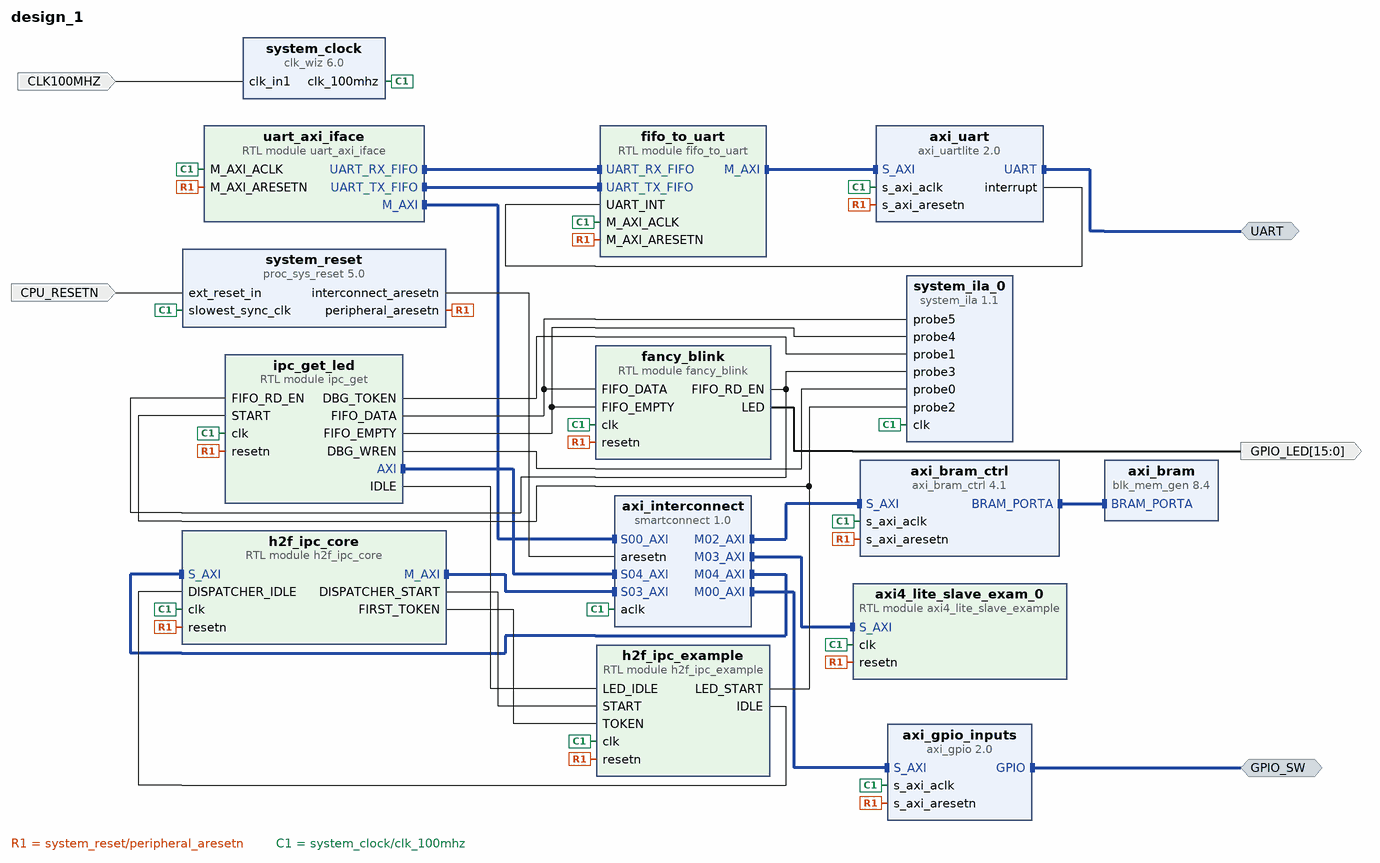
[diagram p0: block diagram of the top level]
# Vivado block design design_1, xc7a100tcsg324-1, Vivado 2021.1
create_bd_design design_1

create_bd_intf_port -mode Master -vlnv xilinx.com:interface:gpio_rtl:1.0 GPIO_SW
create_bd_intf_port -mode Master -vlnv xilinx.com:interface:uart_rtl:1.0 UART
create_bd_port -dir I -type clk CLK100MHZ
set_property -dict {CONFIG.ASSOCIATED_RESET CPU_RESETN} [get_bd_ports CLK100MHZ]
create_bd_port -dir I -type rst CPU_RESETN
create_bd_port -dir O -from 15 -to 0 GPIO_LED

create_bd_cell -type ip -vlnv xilinx.com:ip:clk_wiz:6.0 system_clock
set_property -dict [list \
  CONFIG.CLKOUT1_DRIVES BUFGCE \
  CONFIG.CLKOUT1_JITTER 130.958 \
  CONFIG.CLKOUT1_REQUESTED_OUT_FREQ 100 \
  CONFIG.CLKOUT2_DRIVES BUFGCE \
  CONFIG.CLKOUT3_DRIVES BUFGCE \
  CONFIG.CLKOUT4_DRIVES BUFGCE \
  CONFIG.CLKOUT5_DRIVES BUFGCE \
  CONFIG.CLKOUT6_DRIVES BUFGCE \
  CONFIG.CLKOUT7_DRIVES BUFGCE \
  CONFIG.CLK_OUT1_PORT clk_100mhz \
  CONFIG.FEEDBACK_SOURCE FDBK_AUTO \
  CONFIG.MMCM_CLKOUT0_DIVIDE_F 10.000 \
  CONFIG.USE_LOCKED false \
  CONFIG.USE_RESET false \
  CONFIG.USE_SAFE_CLOCK_STARTUP true \
] [get_bd_cells system_clock]
create_bd_cell -type ip -vlnv xilinx.com:ip:proc_sys_reset:5.0 system_reset
set_property -dict {CONFIG.RESET_BOARD_INTERFACE reset CONFIG.USE_BOARD_FLOW true} [get_bd_cells system_reset]
create_bd_cell -type module -reference uart_axi_iface uart_axi_iface
create_bd_cell -type ip -vlnv xilinx.com:ip:smartconnect:1.0 axi_interconnect
set_property -dict {CONFIG.NUM_MI 6 CONFIG.NUM_SI 5} [get_bd_cells axi_interconnect]
create_bd_cell -type ip -vlnv xilinx.com:ip:axi_uartlite:2.0 axi_uart
set_property -dict [list \
  CONFIG.C_BAUDRATE 115200 \
  CONFIG.UARTLITE_BOARD_INTERFACE Custom \
  CONFIG.USE_BOARD_FLOW true \
] [get_bd_cells axi_uart]
create_bd_cell -type ip -vlnv xilinx.com:ip:axi_gpio:2.0 axi_gpio_inputs
set_property -dict [list \
  CONFIG.C_GPIO_WIDTH 4 \
  CONFIG.GPIO_BOARD_INTERFACE Custom \
  CONFIG.USE_BOARD_FLOW true \
] [get_bd_cells axi_gpio_inputs]
create_bd_cell -type module -reference fifo_to_uart fifo_to_uart
create_bd_cell -type ip -vlnv xilinx.com:ip:axi_bram_ctrl:4.1 axi_bram_ctrl
set_property -dict {CONFIG.DATA_WIDTH 256 CONFIG.SINGLE_PORT_BRAM 1} [get_bd_cells axi_bram_ctrl]
create_bd_cell -type ip -vlnv xilinx.com:ip:blk_mem_gen:8.4 axi_bram
set_property -dict [list \
  CONFIG.EN_SAFETY_CKT true \
  CONFIG.Memory_Type Single_Port_RAM \
  CONFIG.Port_B_Clock 0 \
  CONFIG.Port_B_Enable_Rate 0 \
  CONFIG.Port_B_Write_Rate 0 \
] [get_bd_cells axi_bram]
create_bd_cell -type ip -vlnv xilinx.com:ip:system_ila:1.1 system_ila_0
set_property -dict [list \
  CONFIG.C_MON_TYPE NATIVE \
  CONFIG.C_NUM_MONITOR_SLOTS 1 \
  CONFIG.C_NUM_OF_PROBES 6 \
  CONFIG.C_PROBE0_TYPE 0 \
  CONFIG.C_PROBE1_TYPE 0 \
  CONFIG.C_PROBE2_TYPE 0 \
  CONFIG.C_PROBE3_TYPE 0 \
  CONFIG.C_PROBE4_TYPE 0 \
  CONFIG.C_PROBE5_TYPE 0 \
  CONFIG.C_PROBE6_TYPE 0 \
  CONFIG.C_PROBE7_TYPE 0 \
  CONFIG.C_SLOT_0_APC_EN 0 \
  CONFIG.C_SLOT_0_AXI_AR_SEL_DATA 1 \
  CONFIG.C_SLOT_0_AXI_AR_SEL_TRIG 1 \
  CONFIG.C_SLOT_0_AXI_AW_SEL_DATA 1 \
  CONFIG.C_SLOT_0_AXI_AW_SEL_TRIG 1 \
  CONFIG.C_SLOT_0_AXI_B_SEL_DATA 1 \
  CONFIG.C_SLOT_0_AXI_B_SEL_TRIG 1 \
  CONFIG.C_SLOT_0_AXI_R_SEL_DATA 1 \
  CONFIG.C_SLOT_0_AXI_R_SEL_TRIG 1 \
  CONFIG.C_SLOT_0_AXI_W_SEL_DATA 1 \
  CONFIG.C_SLOT_0_AXI_W_SEL_TRIG 1 \
  CONFIG.C_SLOT_0_INTF_TYPE xilinx.com:interface:aximm_rtl:1.0 \
  CONFIG.C_SLOT_1_APC_EN 0 \
  CONFIG.C_SLOT_1_AXI_AR_SEL_DATA 1 \
  CONFIG.C_SLOT_1_AXI_AR_SEL_TRIG 1 \
  CONFIG.C_SLOT_1_AXI_AW_SEL_DATA 1 \
  CONFIG.C_SLOT_1_AXI_AW_SEL_TRIG 1 \
  CONFIG.C_SLOT_1_AXI_B_SEL_DATA 1 \
  CONFIG.C_SLOT_1_AXI_B_SEL_TRIG 1 \
  CONFIG.C_SLOT_1_AXI_R_SEL_DATA 1 \
  CONFIG.C_SLOT_1_AXI_R_SEL_TRIG 1 \
  CONFIG.C_SLOT_1_AXI_W_SEL_DATA 1 \
  CONFIG.C_SLOT_1_AXI_W_SEL_TRIG 1 \
  CONFIG.C_SLOT_1_INTF_TYPE xilinx.com:interface:aximm_rtl:1.0 \
] [get_bd_cells system_ila_0]
create_bd_cell -type module -reference axi4_lite_slave_example axi4_lite_slave_exam_0
create_bd_cell -type module -reference h2f_ipc_core h2f_ipc_core
create_bd_cell -type module -reference h2f_ipc_example h2f_ipc_example
create_bd_cell -type module -reference ipc_get ipc_get_led
create_bd_cell -type module -reference fancy_blink fancy_blink

# ---- connections ----

connect_bd_intf_net -intf_net axi_bram_ctrl_0_BRAM_PORTA [get_bd_intf_pins axi_bram/BRAM_PORTA] [get_bd_intf_pins axi_bram_ctrl/BRAM_PORTA]
connect_bd_intf_net [get_bd_intf_ports GPIO_SW] [get_bd_intf_pins axi_gpio_inputs/GPIO]
connect_bd_intf_net [get_bd_intf_pins axi_interconnect/M00_AXI] [get_bd_intf_pins axi_gpio_inputs/S_AXI]
connect_bd_intf_net [get_bd_intf_pins axi_bram_ctrl/S_AXI] [get_bd_intf_pins axi_interconnect/M02_AXI]
connect_bd_intf_net [get_bd_intf_pins axi_interconnect/M03_AXI] [get_bd_intf_pins axi4_lite_slave_exam_0/S_AXI]
connect_bd_intf_net [get_bd_intf_pins axi_interconnect/M04_AXI] [get_bd_intf_pins h2f_ipc_core/S_AXI]
connect_bd_intf_net [get_bd_intf_ports UART] [get_bd_intf_pins axi_uart/UART]
connect_bd_intf_net [get_bd_intf_pins axi_uart/S_AXI] [get_bd_intf_pins fifo_to_uart/M_AXI]
connect_bd_intf_net -intf_net h2f_ipc_core_0_M_AXI [get_bd_intf_pins h2f_ipc_core/M_AXI] [get_bd_intf_pins axi_interconnect/S03_AXI]
connect_bd_intf_net -intf_net ipc_get_0_AXI [get_bd_intf_pins ipc_get_led/AXI] [get_bd_intf_pins axi_interconnect/S04_AXI]
connect_bd_intf_net [get_bd_intf_pins axi_interconnect/S00_AXI] [get_bd_intf_pins uart_axi_iface/M_AXI]
connect_bd_intf_net [get_bd_intf_pins fifo_to_uart/UART_RX_FIFO] [get_bd_intf_pins uart_axi_iface/UART_RX_FIFO]
connect_bd_intf_net [get_bd_intf_pins fifo_to_uart/UART_TX_FIFO] [get_bd_intf_pins uart_axi_iface/UART_TX_FIFO]
connect_bd_net -net DBG_TOKEN [get_bd_pins ipc_get_led/DBG_TOKEN] [get_bd_pins system_ila_0/probe1]
connect_bd_net -net DBG_WREN [get_bd_pins ipc_get_led/DBG_WREN] [get_bd_pins system_ila_0/probe0]
connect_bd_net -net axi_uartlite_0_interrupt [get_bd_pins axi_uart/interrupt] [get_bd_pins fifo_to_uart/UART_INT]
connect_bd_net -net clk_in1_0_1 [get_bd_ports CLK100MHZ] [get_bd_pins system_clock/clk_in1]
connect_bd_net -net ext_reset_in_0_1 [get_bd_ports CPU_RESETN] [get_bd_pins system_reset/ext_reset_in]
connect_bd_net -net fancy_blink_0_FIFO_RD_EN [get_bd_pins fancy_blink/FIFO_RD_EN] \
  [get_bd_pins system_ila_0/probe3] [get_bd_pins ipc_get_led/FIFO_RD_EN]
connect_bd_net -net fancy_blink_0_LED [get_bd_pins fancy_blink/LED] [get_bd_ports GPIO_LED]
connect_bd_net [get_bd_pins h2f_ipc_core/DISPATCHER_START] [get_bd_pins h2f_ipc_example/START]
connect_bd_net [get_bd_pins h2f_ipc_core/FIRST_TOKEN] [get_bd_pins h2f_ipc_example/TOKEN]
connect_bd_net -net h2f_ipc_example_0_IDLE [get_bd_pins h2f_ipc_example/IDLE] [get_bd_pins h2f_ipc_core/DISPATCHER_IDLE]
connect_bd_net -net h2f_ipc_example_LED_START [get_bd_pins h2f_ipc_example/LED_START] \
  [get_bd_pins system_ila_0/probe2] [get_bd_pins ipc_get_led/START]
connect_bd_net -net ipc_get_0_IDLE [get_bd_pins ipc_get_led/IDLE] [get_bd_pins h2f_ipc_example/LED_IDLE]
connect_bd_net -net ipc_get_led_FIFO_DATA [get_bd_pins ipc_get_led/FIFO_DATA] [get_bd_pins system_ila_0/probe5] [get_bd_pins fancy_blink/FIFO_DATA]
connect_bd_net -net ipc_get_led_FIFO_EMPTY [get_bd_pins ipc_get_led/FIFO_EMPTY] [get_bd_pins system_ila_0/probe4] [get_bd_pins fancy_blink/FIFO_EMPTY]
connect_bd_net -net proc_sys_reset_0_peripheral_aresetn [get_bd_pins system_reset/peripheral_aresetn] \
  [get_bd_pins uart_axi_iface/M_AXI_ARESETN] [get_bd_pins axi_uart/s_axi_aresetn] [get_bd_pins axi_gpio_inputs/s_axi_aresetn] \
  [get_bd_pins fifo_to_uart/M_AXI_ARESETN] [get_bd_pins axi_bram_ctrl/s_axi_aresetn] \
  [get_bd_pins axi4_lite_slave_exam_0/resetn] [get_bd_pins h2f_ipc_core/resetn] [get_bd_pins h2f_ipc_example/resetn] \
  [get_bd_pins ipc_get_led/resetn] [get_bd_pins fancy_blink/resetn]
connect_bd_net [get_bd_pins system_clock/clk_100mhz] \
  [get_bd_pins system_reset/slowest_sync_clk] [get_bd_pins uart_axi_iface/M_AXI_ACLK] [get_bd_pins axi_interconnect/aclk] \
  [get_bd_pins axi_uart/s_axi_aclk] [get_bd_pins axi_gpio_inputs/s_axi_aclk] [get_bd_pins fifo_to_uart/M_AXI_ACLK] \
  [get_bd_pins axi_bram_ctrl/s_axi_aclk] [get_bd_pins system_ila_0/clk] [get_bd_pins axi4_lite_slave_exam_0/clk] \
  [get_bd_pins h2f_ipc_core/clk] [get_bd_pins h2f_ipc_example/clk] [get_bd_pins ipc_get_led/clk] \
  [get_bd_pins fancy_blink/clk]
connect_bd_net [get_bd_pins system_reset/interconnect_aresetn] [get_bd_pins axi_interconnect/aresetn]
set_property HDL_ATTRIBUTE.DEBUG true [get_bd_nets DBG_TOKEN]
set_property HDL_ATTRIBUTE.MARK_DEBUG true [get_bd_nets DBG_TOKEN]
set_property HDL_ATTRIBUTE.DEBUG true [get_bd_nets DBG_WREN]
set_property HDL_ATTRIBUTE.MARK_DEBUG true [get_bd_nets DBG_WREN]
set_property HDL_ATTRIBUTE.DEBUG true [get_bd_nets fancy_blink_0_FIFO_RD_EN]
set_property HDL_ATTRIBUTE.MARK_DEBUG true [get_bd_nets fancy_blink_0_FIFO_RD_EN]
set_property HDL_ATTRIBUTE.DEBUG true [get_bd_nets h2f_ipc_example_LED_START]
set_property HDL_ATTRIBUTE.MARK_DEBUG true [get_bd_nets h2f_ipc_example_LED_START]
set_property HDL_ATTRIBUTE.DEBUG true [get_bd_nets ipc_get_led_FIFO_DATA]
set_property HDL_ATTRIBUTE.MARK_DEBUG true [get_bd_nets ipc_get_led_FIFO_DATA]
set_property HDL_ATTRIBUTE.DEBUG true [get_bd_nets ipc_get_led_FIFO_EMPTY]
set_property HDL_ATTRIBUTE.MARK_DEBUG true [get_bd_nets ipc_get_led_FIFO_EMPTY]

# ---- address map ----
assign_bd_address -offset 0x40600000 -range 256 -target_address_space [get_bd_addr_spaces fifo_to_uart/M_AXI] [get_bd_addr_segs axi_uart/S_AXI/Reg]
assign_bd_address -offset 0x0000000040000000 -range 256 -target_address_space [get_bd_addr_spaces h2f_ipc_core/M_AXI] [get_bd_addr_segs axi_gpio_inputs/S_AXI/Reg]
assign_bd_address -offset 0x0000000040020000 -range 256 -target_address_space [get_bd_addr_spaces h2f_ipc_core/M_AXI] [get_bd_addr_segs axi4_lite_slave_exam_0/S_AXI/reg0]
assign_bd_address -offset 0x0000000040040000 -range 256 -target_address_space [get_bd_addr_spaces h2f_ipc_core/M_AXI] [get_bd_addr_segs h2f_ipc_core/S_AXI/reg0]
assign_bd_address -offset 0x00000000C0000000 -range 8K -target_address_space [get_bd_addr_spaces h2f_ipc_core/M_AXI] [get_bd_addr_segs axi_bram_ctrl/S_AXI/Mem0]
assign_bd_address -offset 0x0000000040000000 -range 256 -target_address_space [get_bd_addr_spaces ipc_get_led/AXI] [get_bd_addr_segs axi_gpio_inputs/S_AXI/Reg]
assign_bd_address -offset 0x0000000040020000 -range 256 -target_address_space [get_bd_addr_spaces ipc_get_led/AXI] [get_bd_addr_segs axi4_lite_slave_exam_0/S_AXI/reg0]
assign_bd_address -offset 0x0000000040040000 -range 256 -target_address_space [get_bd_addr_spaces ipc_get_led/AXI] [get_bd_addr_segs h2f_ipc_core/S_AXI/reg0]
assign_bd_address -offset 0x00000000C0000000 -range 8K -target_address_space [get_bd_addr_spaces ipc_get_led/AXI] [get_bd_addr_segs axi_bram_ctrl/S_AXI/Mem0]
assign_bd_address -offset 0x40000000 -range 256 -target_address_space [get_bd_addr_spaces uart_axi_iface/M_AXI] [get_bd_addr_segs axi_gpio_inputs/S_AXI/Reg]
assign_bd_address -offset 0x40020000 -range 256 -target_address_space [get_bd_addr_spaces uart_axi_iface/M_AXI] [get_bd_addr_segs axi4_lite_slave_exam_0/S_AXI/reg0]
assign_bd_address -offset 0x40040000 -range 256 -target_address_space [get_bd_addr_spaces uart_axi_iface/M_AXI] [get_bd_addr_segs h2f_ipc_core/S_AXI/reg0]
assign_bd_address -offset 0xC0000000 -range 8K -target_address_space [get_bd_addr_spaces uart_axi_iface/M_AXI] [get_bd_addr_segs axi_bram_ctrl/S_AXI/Mem0]

validate_bd_design
save_bd_design
